# Altium schematic sheet mcu.SchDoc: CS - MCU
size Letter; CheckedBy: J. Brinton; CompanyName: Signal Laboratories, Inc.; DrawnBy: J. Brinton; Engineer: J. Brinton; Address1: 3479 Edison Way; Address2: Menlo Park CA 94025; Address3: +1 (877) 778-8435; Address4: siglabs.com; Revision: 3; SheetNumber: 17; SheetTotal: 47
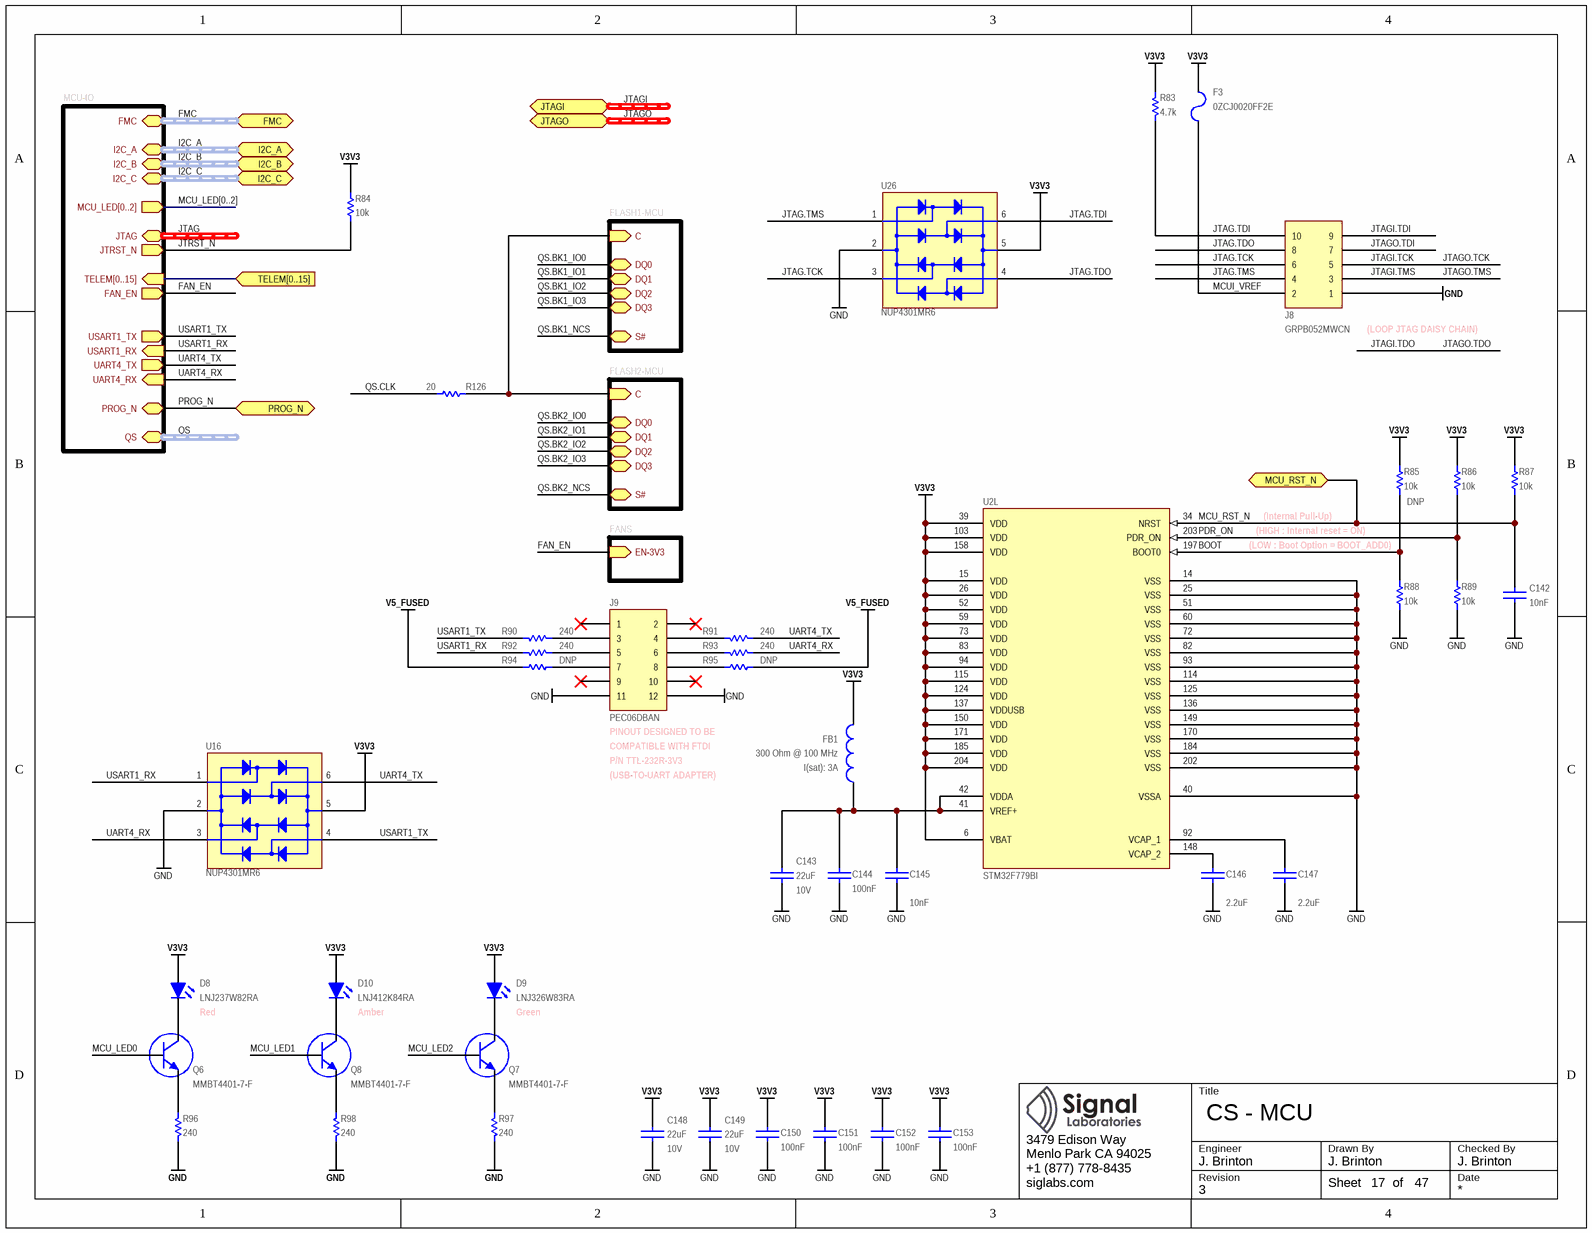
[diagram p0: mcu.SchDoc]

## Parts
C142  value 10nF  [CAPC100X50X55L25N]  (hidden comment: GRM155R71H103KA88)
C143  value 22uF  Voltage: 10V  [CAPC200X125X145L45N]  (hidden comment: C2012X7S1A226M125)
C144  value 100nF  [CAPC100X50X55L25N]  (hidden comment: GCM155R71H104KE02)
C145  value 10nF  [CAPC100X50X55L25N]  (hidden comment: GRM155R71H103KA88)
C146  value 2.2uF  [CAPC160X80X90L20N]  (hidden comment: C1608X7R1A225M080)
C147  value 2.2uF  [CAPC160X80X90L20N]  (hidden comment: C1608X7R1A225M080)
C148  value 22uF  Voltage: 10V  [CAPC200X125X145L45N]  (hidden comment: C2012X7S1A226M125)
C149  value 22uF  Voltage: 10V  [CAPC200X125X145L45N]  (hidden comment: C2012X7S1A226M125)
C150  value 100nF  [CAPC100X50X55L25N]  (hidden comment: GCM155R71H104KE02)
C151  value 100nF  [CAPC100X50X55L25N]  (hidden comment: GCM155R71H104KE02)
C152  value 100nF  [CAPC100X50X55L25N]  (hidden comment: GCM155R71H104KE02)
C153  value 100nF  [CAPC100X50X55L25N]  (hidden comment: GCM155R71H104KE02)
D8  LNJ237W82RA  [0603_LED]
D9  LNJ326W83RA  [0603_LED]
D10  LNJ412K84RA  [0603_LED]
F3  0ZCJ0020FF2E  [1206]
FB1  value 300 Ohm @ 100 MHz  I(sat): 3A  [0805]  (hidden comment: 742792031)
J8  GRPB052MWCN  [GRPB052MWCN]
J9  PEC06DBAN  [HDR2X6H]
Q6  MMBT4401-7-F  [SOT23]
Q7  MMBT4401-7-F  [SOT23]
Q8  MMBT4401-7-F  [SOT23]
R83  value 4.7k  [RESC1005X40N]  (hidden comment: ERJ-2RKF4701X)
R84  value 10k  [RESC1005X40N]  (hidden comment: ERJ-2RKF1002X)
R85  value 10k  Do Not Place: DNP  [RESC1005X40N]  (hidden comment: ERJ-2RKF1002X)
R86  value 10k  [RESC1005X40N]  (hidden comment: ERJ-2RKF1002X)
R87  value 10k  [RESC1005X40N]  (hidden comment: ERJ-2RKF1002X)
R88  value 10k  [RESC1005X40N]  (hidden comment: ERJ-2RKF1002X)
R89  value 10k  [RESC1005X40N]  (hidden comment: ERJ-2RKF1002X)
R90  value 240  [RESC1005X40N]  (hidden comment: ERJ-2RKF2400X)
R91  value 240  [RESC1005X40N]  (hidden comment: ERJ-2RKF2400X)
R92  value 240  [RESC1005X40N]  (hidden comment: ERJ-2RKF2400X)
R93  value 240  [RESC1005X40N]  (hidden comment: ERJ-2RKF2400X)
R94  Do Not Place: DNP  [SOLDERLINK0603X26N]  (hidden comment: SOLDER_LINK)  (no BOM)
R95  Do Not Place: DNP  [SOLDERLINK0603X26N]  (hidden comment: SOLDER_LINK)  (no BOM)
R96  value 240  [RESC1005X40N]  (hidden comment: ERJ-2RKF2400X)
R97  value 240  [RESC1005X40N]  (hidden comment: ERJ-2RKF2400X)
R98  value 240  [RESC1005X40N]  (hidden comment: ERJ-2RKF2400X)
R126  value 20  [RESC1005X40N]  (hidden comment: ERJ-2RKF20R0X)
U2  STM32F779BI  [LQFP208]  (part L of 12)
U16  NUP4301MR6  [SOT23-6]
U26  NUP4301MR6  [SOT23-6]

## Sub-sheets
FANS = FANs.SchDoc: EN-3V3 (in)
FLASH1-MCU = flash.SchDoc: C (in), DQ0 (bidir), DQ1 (bidir), DQ2 (bidir), DQ3 (bidir), S# (bidir)
FLASH2-MCU = flash.SchDoc: C (in), DQ0 (bidir), DQ1 (bidir), DQ2 (bidir), DQ3 (bidir), S# (bidir)
MCU-IO = mcu-io.SchDoc: I2C_A (harness I2C-3V3), I2C_B (harness I2C-3V3), I2C_C (harness I2C-3V3), JTAG (harness JTAG-3V3), MCU_LED[0..2] (out), TELEM[0..15] (in), FAN_EN (out), JTRST_N (out), USART1_RX (in), UART4_TX (out), USART1_TX (out), UART4_RX (in), QS (harness QSPI-3V3), FMC (harness FMC-3V3), PROG_N (bidir)

## Ports
FMC (harness FMC-3V3), I2C_A (harness I2C-3V3), I2C_B (harness I2C-3V3), I2C_C (harness I2C-3V3), JTAGI (harness JTAG-3V3), JTAGO (harness JTAG-3V3), MCU_RST_N (bidir), PROG_N (bidir), TELEM[0..15] (in)

## Nets
GND: C142.1 C143.2 C144.1 C145.1 C146.1 C147.1 C148.2 C149.2 C150.1 C151.1 C152.1 C153.1 J8.1 J9.11 J9.12 R88.1 R89.1 R96.2 R97.2 R98.2 U2.14(VSS) U2.25(VSS) U2.40(VSSA) U2.51(VSS) U2.60(VSS) U2.72(VSS) U2.82(VSS) U2.93(VSS) U2.114(VSS) U2.125(VSS) U2.136(VSS) U2.149(VSS) U2.170(VSS) U2.184(VSS) U2.202(VSS) U16.2(VN) U26.2(VN)
V3V3: C148.1 C149.1 C150.2 C151.2 C152.2 C153.2 D8.1(A) D9.1(A) D10.1(A) F3.1 FB1.2 R83.2 R84.2 R85.2 R86.2 R87.2 U2.6(VBAT) U2.15(VDD) U2.26(VDD) U2.39(VDD) U2.52(VDD) U2.59(VDD) U2.73(VDD) U2.83(VDD) U2.94(VDD) U2.103(VDD) U2.115(VDD) U2.124(VDD) U2.137(VDDUSB) U2.150(VDD) U2.158(VDD) U2.171(VDD) U2.185(VDD) U2.204(VDD) U16.5(VP) U26.5(VP)
V5_FUSED: R94.2 R95.1
BOOT: R85.1 R88.2 U2.197(BOOT0)
FAN_EN: sheet FANS/EN-3V3, sheet MCU-IO/FAN_EN
JTAG.TCK: J8.6 U26.3(B)
JTAG.TDI: J8.10 R83.1 U26.6(D)
JTAG.TDO: J8.8 U26.4(C)
JTAG.TMS: J8.4 U26.1(A)
JTAGI.TCK: J8.5  [also labelled JTAGO.TCK]
JTAGI.TDI: J8.9
JTAGI.TMS: J8.3  [also labelled JTAGO.TMS]
JTAGO.TDI: J8.7
JTRST_N: R84.1 ; sheet MCU-IO/JTRST_N
MCU_LED0: Q6.1(B)
MCU_LED1: Q8.1(B)
MCU_LED2: Q7.1(B)
MCU_RST_N: C142.2 R87.1 U2.34(NRST) ; port MCU_RST_N
MCUI_VREF: F3.2 J8.2
PDR_ON: R86.1 R89.2 U2.203(PDR_ON)
PROG_N: port PROG_N, sheet MCU-IO/PROG_N
QS.BK1_IO0: sheet FLASH1-MCU/DQ0
QS.BK1_IO1: sheet FLASH1-MCU/DQ1
QS.BK1_IO2: sheet FLASH1-MCU/DQ2
QS.BK1_IO3: sheet FLASH1-MCU/DQ3
QS.BK1_NCS: sheet FLASH1-MCU/S#
QS.BK2_IO0: sheet FLASH2-MCU/DQ0
QS.BK2_IO1: sheet FLASH2-MCU/DQ1
QS.BK2_IO2: sheet FLASH2-MCU/DQ2
QS.BK2_IO3: sheet FLASH2-MCU/DQ3
QS.BK2_NCS: sheet FLASH2-MCU/S#
QS.CLK: R126.1
UART4_RX: R93.2 U16.3(B) ; sheet MCU-IO/UART4_RX
UART4_TX: R91.2 U16.6(D) ; sheet MCU-IO/UART4_TX
USART1_RX: R92.1 U16.1(A) ; sheet MCU-IO/USART1_RX
USART1_TX: R90.1 U16.4(C) ; sheet MCU-IO/USART1_TX
NetC143_1: C143.1 C144.2 C145.2 FB1.1 U2.41(VREF+) U2.42(VDDA)
NetC146_2: C146.2 U2.148(VCAP_2)
NetC147_2: C147.2 U2.92(VCAP_1)
NetD8_2: D8.2(K) Q6.3(C)
NetD9_2: D9.2(K) Q7.3(C)
NetD10_2: D10.2(K) Q8.3(C)
NetJ9_3: J9.3 R90.2
NetJ9_4: J9.4 R91.1
NetJ9_5: J9.5 R92.2
NetJ9_6: J9.6 R93.1
NetJ9_7: J9.7 R94.1
NetJ9_8: J9.8 R95.2
NetQ6_2: Q6.2(E) R96.1
NetQ7_2: Q7.2(E) R97.1
NetQ8_2: Q8.2(E) R98.1
NetR126_2: R126.2 ; sheet FLASH1-MCU/C, sheet FLASH2-MCU/C

Not connected (* = marked no-connect by the designer): J9 1* 2* 9* 10*

## Buses and harness runs
bus MCU_LED[0..2] = sheet MCU-IO/MCU_LED[0..2]
bus port TELEM[0..15] = sheet MCU-IO/TELEM[0..15]
harness FMC = port FMC = sheet MCU-IO/FMC
harness I2C_A = port I2C_A = sheet MCU-IO/I2C_A
harness I2C_B = port I2C_B = sheet MCU-IO/I2C_B
harness I2C_C = port I2C_C = sheet MCU-IO/I2C_C
harness JTAG = sheet MCU-IO/JTAG
harness JTAGI = port JTAGI
harness JTAGO = port JTAGO
harness QS = sheet MCU-IO/QS

## Notes on the sheet
- (near J8) (LOOP JTAG DAISY CHAIN)
- (HIGH : Internal reset = ON)
- (Internal Pull-Up)
- (LOW : Boot Option = BOOT_ADD0)
- (near J9) PINOUT DESIGNED TO BE
- (near J9) COMPATIBLE WITH FTDI
- P/N TTL-232R-3V3
- (USB-TO-UART ADAPTER)
- Red
- Amber
- Green
- Title
- Engineer
- Revision
- Drawn By
- Checked By
- Date
- Sheet
- of

## Library data of the parts
C142 C145 = CAP: Ceramic Capacitor 10nF ±10% 50V X7R 0402; Manufacturer: Murata; Tr: -55:125; Tolerance: ±10%; Manufacturer P/N: GRM155R71H103KA88; Voltage: 50V; Package: 0402
C143 C148 C149 = CAP: Ceramic Capacitor 22uF ±20% 10V X7S 0805; Manufacturer: TDK; Tr: -55:125; Manufacturer P/N: C2012X7S1A226M125; Tolerance: ±20%; Package: 0805
C144 C150-C153 = CAP: Ceramic Capacitor 100nF ±10% 50V X7R 0402; Manufacturer: Murata; Tr: -55:125; Voltage: 50V; Manufacturer P/N: GCM155R71H104KE02; Tolerance: ±10%; Footprint: *; Package: 0402
C146 C147 = CAP: Ceramic Capacitor 2.2uF ±20% 10V X7R 0603; Manufacturer: TDK; Tr: -55:125; Tolerance: ±20%; Manufacturer P/N: C1608X7R1A225M080; Package: 0603; Voltage: 10V
D8 = LED0603RD: LED, SMT 0603, Color Red, 5mA, 1.85V; Manufacturer: Panasonic; Manufacturer P/N: LNJ237W82RA; Package: 0603 Polarized
D9 = LED0603GR: LED, SMT 0603, Color Green, 10mA, 2.05V; Manufacturer: Panasonic; Manufacturer P/N: LNJ326W83RA; Package: 0603 Polarized
D10 = LED0603Y: LED, SMT 0603, Color Amber, 10mA, 2.05V; Manufacturer: Panasonic; Manufacturer P/N: LNJ412K84RA; Package: 0603 Polarized
F3 = 0ZCJ0020FF2E: PTC Resettable Fuse, 0.2A, 30V, SMD 1206; Manufacturer: Bell Fuse; Manufacturer P/N: 0ZCJ0020FF2E
FB1 = INDUCTOR: Ferrite Chip 300 Ohm @ 100MHz; 3A; Manufacturer: Wurth Electronics, Inc; Manufacturer P/N: 742792031; Package: 0805
J8 = GRPB052VWVN: Male Header, 0.050" Pitch, 2x5 Position, Right Angle; Manufacturer: Sullins; Manufacturer P/N: GRPB052MWCN
J9 = Header 6X2H: Header, 6-Pin, Dual row, Right Angle; Manufacturer: Sullins; Manufacturer P/N: PEC06DBAN
Q6-Q8 = MMBT4401-7-F: NPN Small Signal Transistor SMD SOT-23; Manufacturer: Diodes, Inc.; Manufacturer P/N: MMBT4401-7-F
R83 = RES: Thick Film Resistor 4.7k ±1% 0.1W 75V 0402; Manufacturer: Panasonic; Tcr: ±100; Tr: -55:155; Voltage: 75; Power: 0.1; Tolerance: ±1%; Manufacturer P/N: ERJ-2RKF4701X; Alternatives: *; Footprint: *; Package: 0402
R84-R89 = RES: Thick Film Resistor 10k ±1% 0.1W 50V 0402; Manufacturer: Panasonic; Tcr: ±100; Tr: -55:155; Voltage: 50; Power: 0.1; Manufacturer P/N: ERJ-2RKF1002X; Tolerance: ±1%; Alternatives: *; Footprint: *; Package: 0402
R90-R93 R96-R98 = RES: Thick Film Resistor 240 ±1% 0.1W 75V 0402; Manufacturer: Panasonic; Tcr: ±100; Tr: -55:155; Voltage: 75; Power: 0.1; Tolerance: ±1%; Manufacturer P/N: ERJ-2RKF2400X; Alternatives: *; Footprint: *; Package: 0402
R94 R95 = RES: Solder Link; Manufacturer P/N: *; Manufacturer: *
R126 = RES: Thick Film Resistor 20 ±1% 0.1W 75V 0402; Manufacturer: Panasonic; Tcr: ±100; Tr: -55:155; Voltage: 75; Power: 0.1; Tolerance: ±1%; Manufacturer P/N: ERJ-2RKF20R0X; Alternatives: *; Footprint: *; Package: 0402
U2 = STM32F746BGT6: STM32 Microcontroller; Manufacturer: ST Microelectronics; Manufacturer P/N: STM32F779BI
U16 U26 = NUP4301MR6: 4-Lane TVS Diode Array; Manufacturer: On Semiconductor; Manufacturer P/N: NUP4301MR6